# EAGLE design touchBoard (EAGLE 9.2.2)
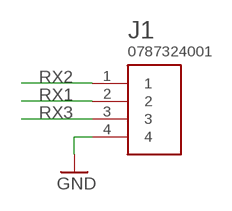
[diagram p0: schematic, sheet 1]

## Parts
J1  0787324001CONTACTS  [0787324001-CONTACTS]

## Nets
GND: J1.4
RX1: J1.2
RX2: J1.1
RX3: J1.3

## Library data of the parts
J1 = thanics-connector:0787324001

## Board
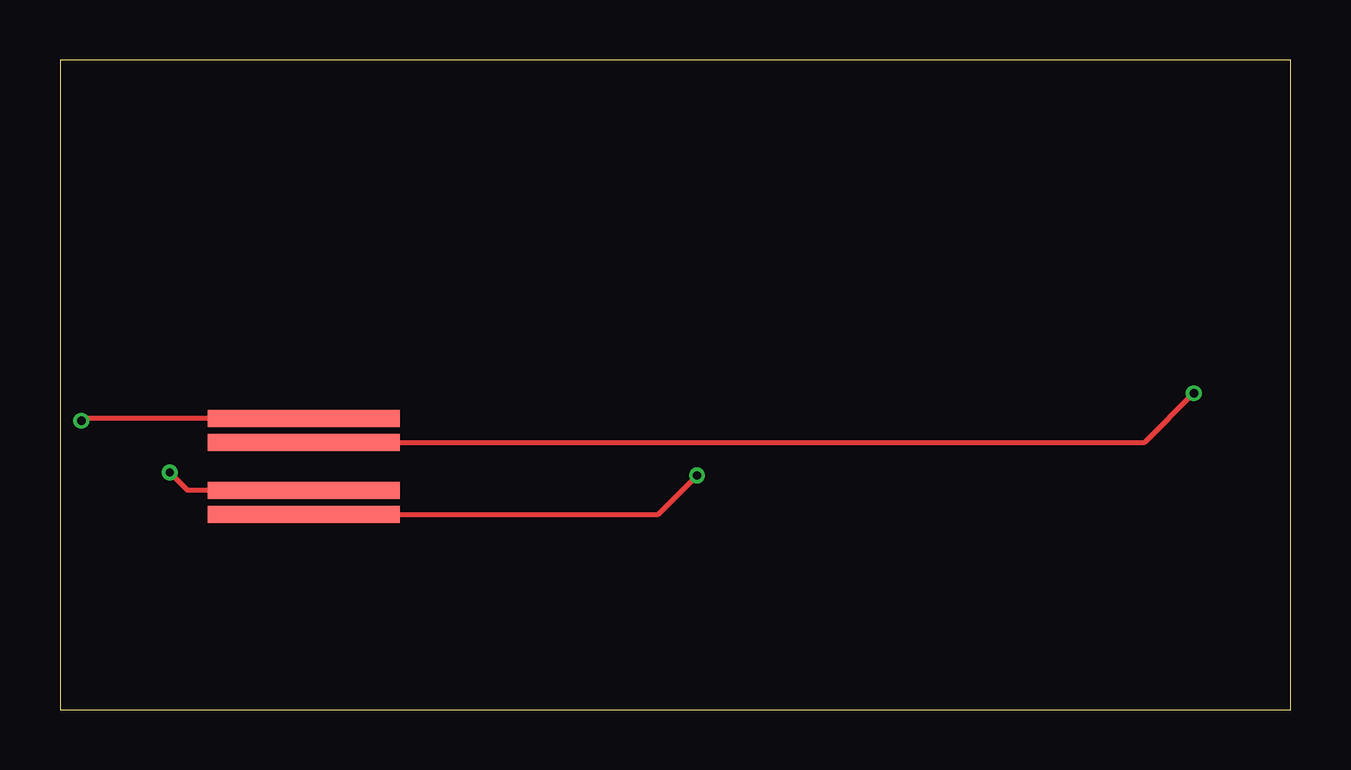
[diagram p1: board, top side]
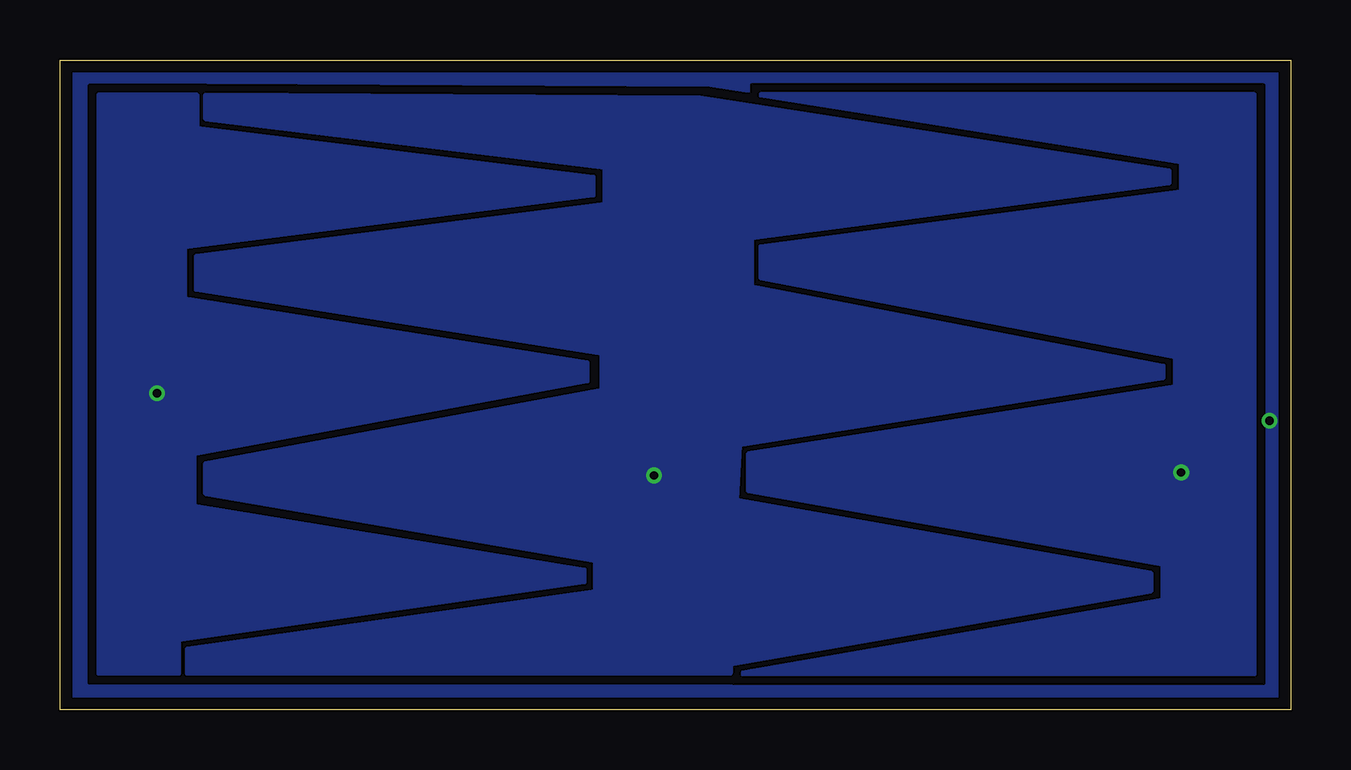
[diagram p2: board, bottom side, seen from below]

Size 51.29 x 27.1 mm. Coordinates in mm from the lower left corner, seen from the top.
Outline: 0,0 51.29,0 51.29,27.1 0,27.1 0,0
Copper layers (1*16): Top 0.035mm / dielectric 1.6mm / Bottom 0.035mm
Design rules "Elecrow_2-layer_PCB_eagle_rule": minimum track width 6mil, minimum drill 12mil, track to track 6mil, track to pad 6mil, pad to pad 6mil, via to via 8mil, smd to smd 0mil, copper to edge 20mil, drill to drill 10mil, minimum pad ring 6mil, minimum via ring 6mil, stop-mask expansion 0mil, vias tented up to drill 100mil, thermal gap 10mil

### Footprints (pad centres in the part's own frame; a part is rotated, then mirrored left to right if it is on the bottom)
0787324001-CONTACTS = smd 0.7 x 8: 1 -2,0; 2 -1,0; 3 1,0; 4 2,0

### Placement (x,y rotation side)
J1  10.16,10.16 90 top

### Tracks (layer width: path | path; a pad name or v marks a point on that pad's centre or on a via)
GND  (via drill 0.35)
  Top 0.203: J1.4 0.98,12.16 v0.89,12.06
  pour Bottom (isolate 0.381, rank 2): -1.02,27.94 52.07,27.94 52.07,-0.51 -1.02,-0.51
RX1  (via drill 0.35)
  Top 0.203: J1.2 5.32,9.16 v4.57,9.91
  pour Bottom: 22.86,1.52 1.52,1.52 1.52,25.65 22.1,25.65 4.57,22.86 4.57,21.59 22.1,19.3 22.1,18.03 4.83,14.73 4.83,13.46 22.61,10.67 22.61,9.14 5.33,6.1 5.33,4.57
RX2  (via drill 0.35)
  Top 0.203: J1.1 24.92,8.16 v26.54,9.78
  pour Bottom: 24.64,25.53 5.08,22.48 5.08,21.97 22.48,19.68 22.48,17.65 5.33,14.35 5.33,13.84 22.99,11.05 23.11,8.76 5.84,5.71 5.84,4.95 23.37,1.91 23.37,1.52 45.97,1.52 45.97,2.54 28.96,4.95 28.96,6.22 45.21,9.02 45.21,10.29 28.7,13.33 28.7,14.86 45.59,17.53 45.59,18.92 28.58,21.08 28.58,22.61 45.21,24.64 45.21,25.65
RX3  (via drill 0.35)
  Top 0.203: J1.3 45.2,11.16 v47.24,13.21
  pour Bottom: 29.08,22.22 29.08,21.46 46.1,19.3 46.1,17.14 29.34,14.48 29.34,13.72 45.72,10.67 45.72,8.51 29.46,5.84 29.46,5.33 46.35,2.92 46.35,1.52 49.66,1.52 49.66,25.65 45.59,25.65 45.59,24.26